# EAGLE design RelayDelayNo7Seg (EAGLE 6.5.0)
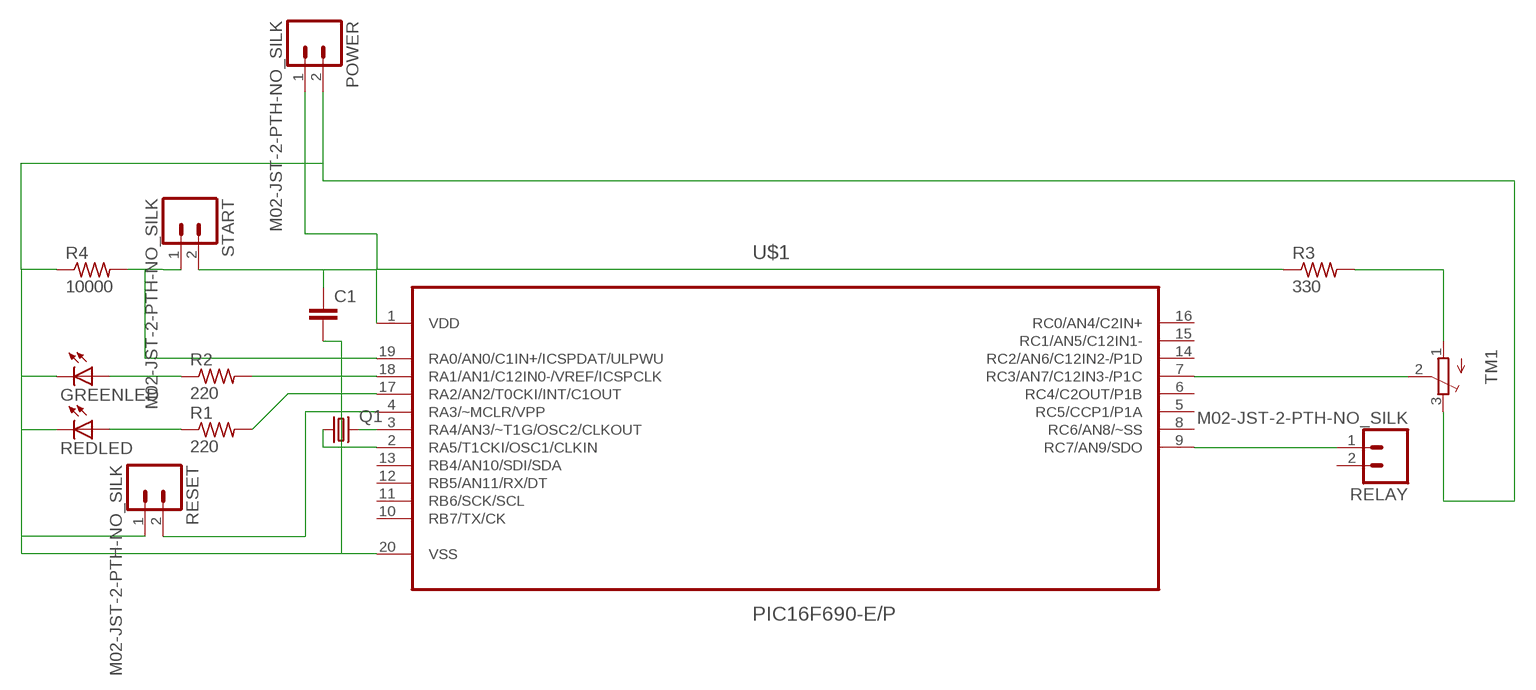
[diagram p0: schematic, sheet 1]

## Parts
C1  CAPEZ  [CAP-PTH-SMALLEZ]
GREENLED  LED5MM  [LED5MM]
POWER  M02-JST-2-PTH-NO_SILK  [JST-2-PTH-NS]
Q1  CRYSTALHC49S  [HC49/S]
R1  220  R-US_0204/2V  [0204V]
R2  220  R-US_0204/2V  [0204V]
R3  330  R-US_0204/2V  [0204V]
R4  10000  R-US_0204/2V  [0204V]
REDLED  LED5MM  [LED5MM]
RELAY  M02-JST-2-PTH-NO_SILK  [JST-2-PTH-NS]
RESET  M02-JST-2-PTH-NO_SILK  [JST-2-PTH-NS]
START  M02-JST-2-PTH-NO_SILK  [JST-2-PTH-NS]
TM1  TRIMPOT3386  [TRIM-3386]
U$1  PIC16F690-E/P  [DIP254P762X533-20]

## Nets
N$1: R2.2 U$1.18(RA1/AN1/C12IN0-/VREF/ICSPCLK)
N$2: GREENLED.A R2.1
N$3: R1.2 U$1.17(RA2/AN2/T0CKI/INT/C1OUT)
N$4: R1.1 REDLED.A
N$5: TM1.2(S) U$1.7(RC3/AN7/C12IN3-/P1C)
N$6: R3.2 TM1.1(A)
N$7: RESET.2 U$1.4(RA3/~MCLR/VPP)
N$8: Q1.1 U$1.2(RA5/T1CKI/OSC1/CLKIN)
N$9: R4.2 START.1 U$1.19(RA0/AN0/C1IN+/ICSPDAT/ULPWU)
N$10: RELAY.1 U$1.9(RC7/AN9/SDO)
N$11: Q1.2 U$1.3(RA4/AN3/~T1G/OSC2/CLKOUT)
N$12: C1.1 POWER.1 R3.1 START.2 U$1.1(VDD)
N$13: C1.2 GREENLED.K(C) POWER.2 R4.1 REDLED.K(C) RESET.1 TM1.3(E) U$1.20(VSS)
Unconnected: RELAY.2 U$1.5(RC5/CCP1/P1A) U$1.6(RC4/C2OUT/P1B) U$1.8(RC6/AN8/~SS) U$1.10(RB7/TX/CK) U$1.11(RB6/SCK/SCL) U$1.12(RB5/AN11/RX/DT) U$1.13(RB4/AN10/SDI/SDA) U$1.14(RC2/AN6/C12IN2-/P1D) U$1.15(RC1/AN5/C12IN1-) U$1.16(RC0/AN4/C2IN+)

## Library data of the parts
C1 = SparkFun-Capacitors:CAP: Capacitor Standard 0603 ceramic capacitor, and 0.1" leaded capacitor.
GREENLED REDLED = SparkFun-LED:LED: LEDs Standard schematic elements and footprints for 5mm, 3mm, 1206, and 0603 sized LEDs. 5mm - Spark Fun Electronics SKU : COM-00529 (and others)
POWER RELAY RESET START = SparkFun-Connectors:M02: Standard 2-pin 0.1" header. Use with - straight break away headers ( PRT-00116) - right angle break away headers (PRT-00553) - swiss pins (PRT-00743) - machine pins (PRT-00117) - female headers (PRT-00115) Molex polarized connector foot print use with: PRT-08233 with associated crimp pins and housings. 2.54_SCREWTERM for use with PRT-10571. 3.5mm Screw Terminal footprints for PRT-08084 5mm Screw Terminal footprints for use with PRT-08433
Q1 = adafruit:CRYSTAL: CRYSTAL; OC_FARNELL: 1667008; OC_NEWARK: unknown
R1-R4 = resistor:R-US_: RESISTOR, American symbol
TM1 = adafruit:TRIMPOT: SMT trimmer potentiometer part number TC33X http://www.ladyada.net/library/eagle
U$1 = Microchip_By_element14_Batch_1:PIC16F690-E/P: CMOS Microcontrollers; MPN: PIC16F690-E/P; OC_FARNELL: 1579589; OC_NEWARK: 56J7545; PACKAGE: DIP-20; SUPPLIER: Microchip

## Board
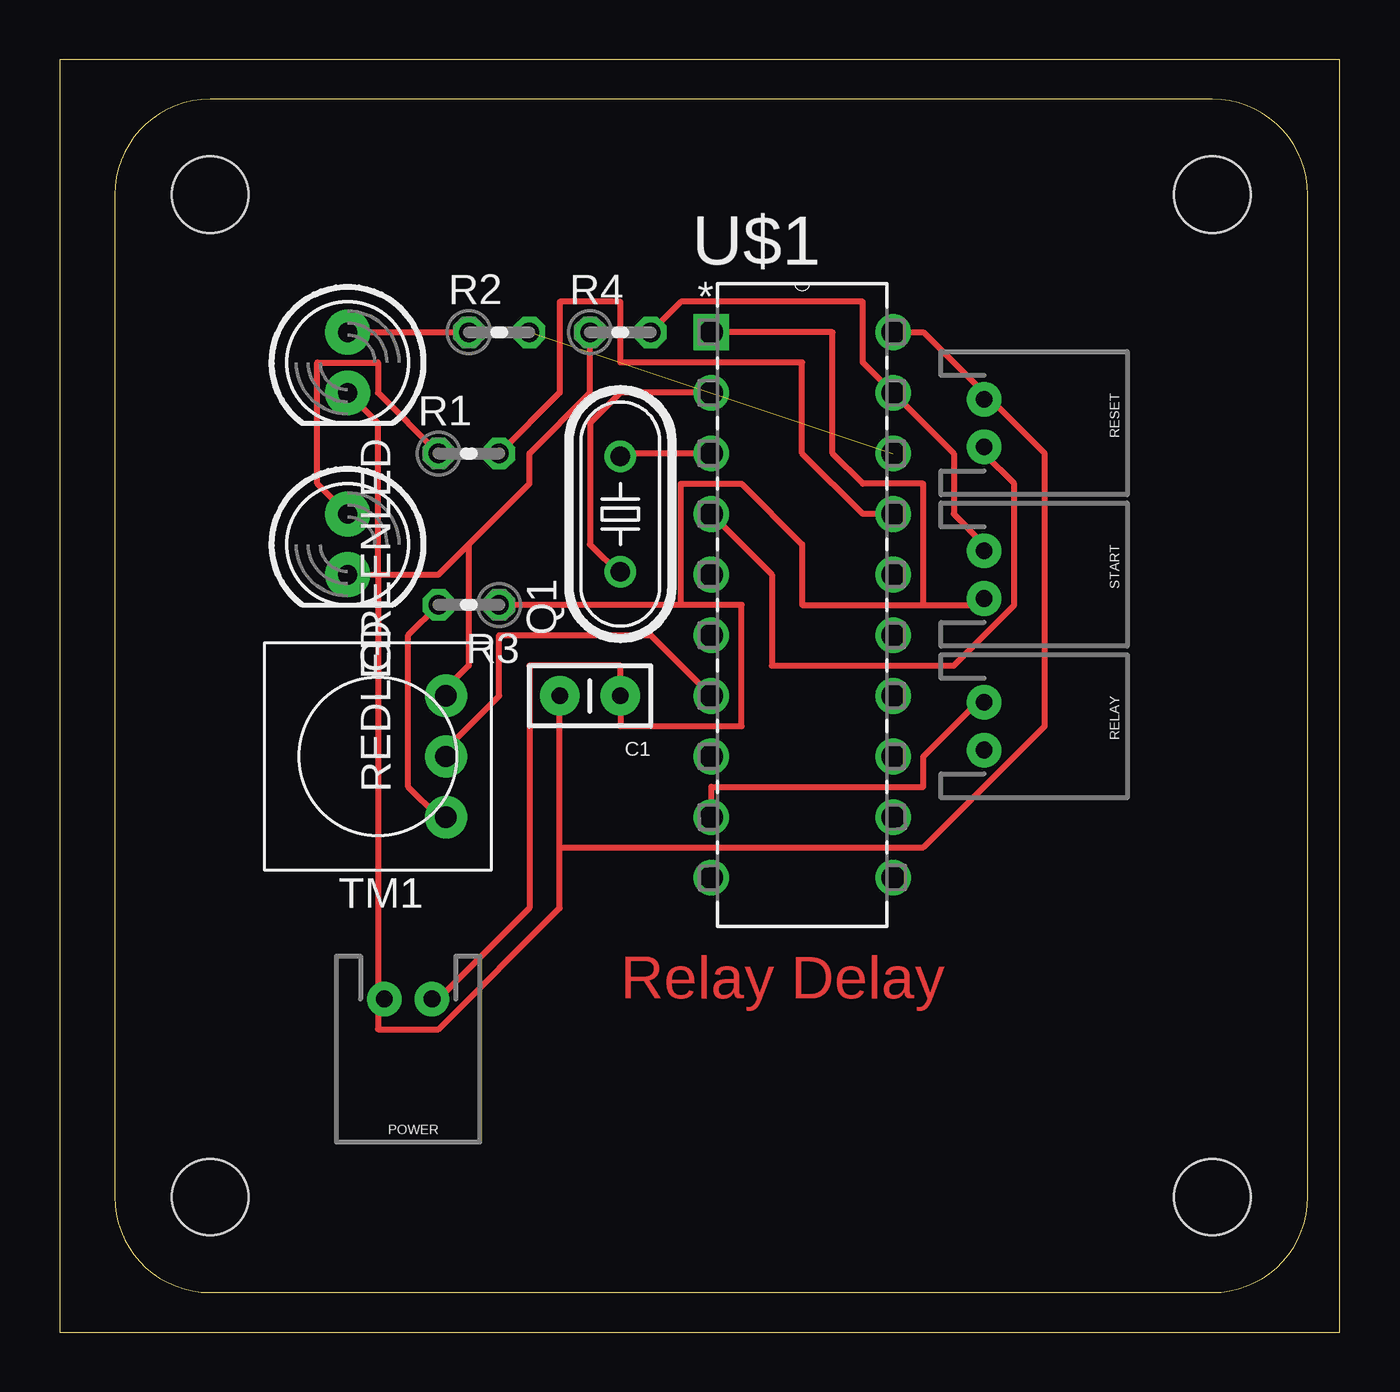
[diagram p1: board, top side]

Size 53.65 x 53.33 mm. Coordinates in mm from the lower left corner, seen from the top.
Outline: 0,0 53.65,0 53.65,53.33 0,53.33 0,0
Copper layers (1*16): Top 0.035mm / dielectric 1.5mm / Bottom 0.035mm
Design rules "default": minimum track width 10mil, minimum drill 24mil, track to track 8mil, track to pad 8mil, pad to pad 8mil, via to via 8mil, smd to smd 8mil, copper to edge 40mil, drill to drill 8mil, minimum pad ring 10mil, minimum via ring 8mil, stop-mask expansion 4mil, vias tented up to drill 0mil, thermal gap 10mil

### Footprints (pad centres in the part's own frame; a part is rotated, then mirrored left to right if it is on the bottom)
CAP-PTH-SMALLEZ = drill 0.7 pad 1.651: 1 0,0; 2 2.54,0
LED5MM = drill 0.813 pad 1.88: A -1.27,0; K 1.27,0
JST-2-PTH-NS = drill 0.7 pad 1.448: 1 -1,0; 2 1,0
HC49/S = drill 0.813: 1 -2.413,0; 2 2.413,0
0204V = drill 0.813 octagon: 1 -1.27,0; 2 1.27,0
TRIM-3386 = drill 0.9 pad 1.778: 1 -2.54,-2.857; 2 0,-2.857; 3 2.54,-2.857
DIP254P762X533-20 = drill 0.991 square: 1 -7.62,22.86 | drill 0.991: 2 -7.62,20.32; 3 -7.62,17.78; 4 -7.62,15.24; 5 -7.62,12.7; 6 -7.62,10.16; 7 -7.62,7.62; 8 -7.62,5.08; 9 -7.62,2.54; 10 -7.62,0; 11 0,0; 12 0,2.54; 13 0,5.08; 14 0,7.62; 15 0,10.16; 16 0,12.7; 17 0,15.24; 18 0,17.78; 19 0,20.32; 20 0,22.86
DP5050_V1 = hole 3.2: -21,-21; 21,-21; 21,21; -21,21

### Placement (x,y rotation side)
C1  23.5,26.67 180 top
GREENLED  12.07,40.64 270 top
POWER  14.61,13.97 180 top
Q1  23.5,34.29 90 top
R1  17.15,36.83 0 top
R2  18.41,41.91 0 top
R3  17.15,30.48 180 top
R4  23.5,41.91 0 top
REDLED  12.07,33.02 270 top
RELAY  38.73,25.4 270 top
RESET  38.73,38.1 270 top
START  38.73,31.75 270 top
TM1  13.34,24.13 90 top
U$1  34.93,19.05 0 top
U$2  [DP5050_V1]  27.3,26.67 0 top

### Tracks (layer width: path | path; a pad name or v marks a point on that pad's centre or on a via)
N$1  (1 unrouted)
N$2
  Top 0.254: GREENLED.A R2.1
N$3
  Top 0.254: R1.2 20.95,39.37 20.95,43.18 23.5,43.18 23.5,40.64 31.12,40.64 31.12,36.83 33.66,34.29 U$1.17
N$4
  Top 0.254: R1.1 13.34,39.37 13.34,40.64 10.8,40.64 10.8,35.56 REDLED.A
N$5
  Top 0.254: U$1.7 24.77,29.21 18.41,29.21 18.41,26.67 15.88,24.13 TM1.2
N$6
  Top 0.254: R3.2 14.61,29.21 14.61,22.86 15.88,21.59 TM1.1
N$7
  Top 0.254: U$1.4 29.84,31.75 29.84,27.94 37.47,27.94 40.01,30.48 40.01,35.56 38.73,36.83 RESET.2
N$8
  Top 0.254: U$1.2 23.5,39.37 22.23,38.1 22.23,33.02 23.5,31.75 Q1.1
N$9
  Top 0.254: R4.2 26.04,43.18 33.66,43.18 33.66,40.64 U$1.19 37.47,36.83 37.47,34.29 38.73,33.02 START.1
N$10
  Top 0.254: U$1.9 27.3,22.86 36.2,22.86 36.2,24.13 38.73,26.67 RELAY.1
N$11
  Top 0.254: U$1.3 23.5,36.83 Q1.2
N$12
  Top 0.254: 26.04,30.48 28.58,30.48 28.58,25.4 23.5,25.4 C1.1 23.5,27.94 19.69,27.94 19.69,17.78 15.88,13.97 POWER.1 | 26.04,30.48 R3.1 | 36.2,30.48 31.12,30.48 31.12,33.02 28.58,35.56 26.04,35.56 26.04,30.48 | 36.2,30.48 38.73,30.48 START.2 | U$1.1 32.38,41.91 32.38,36.83 33.66,35.56 36.2,35.56 36.2,30.48
N$13
  Top 0.254: 38.73,39.37 36.2,41.91 U$1.20 | R4.1 22.23,39.37 19.69,36.83 19.69,35.56 17.15,33.02 | 17.15,33.02 15.88,31.75 13.34,31.75 | REDLED.K 13.34,31.75 | 13.34,31.75 13.34,13.97 | 20.95,20.32 20.95,17.78 15.88,12.7 13.34,12.7 13.34,13.97 | 20.95,20.32 C1.2 | 13.34,13.97 POWER.2 | 17.15,33.02 17.15,27.94 15.88,26.67 TM1.3 | GREENLED.K 13.34,38.1 13.34,31.75 | 38.73,39.37 41.28,36.83 41.28,25.4 36.2,20.32 20.95,20.32 | 38.73,39.37 RESET.1

### Text on the board
Top: Relay Delay